# EAGLE design Phototransistor (EAGLE 9.6.2)
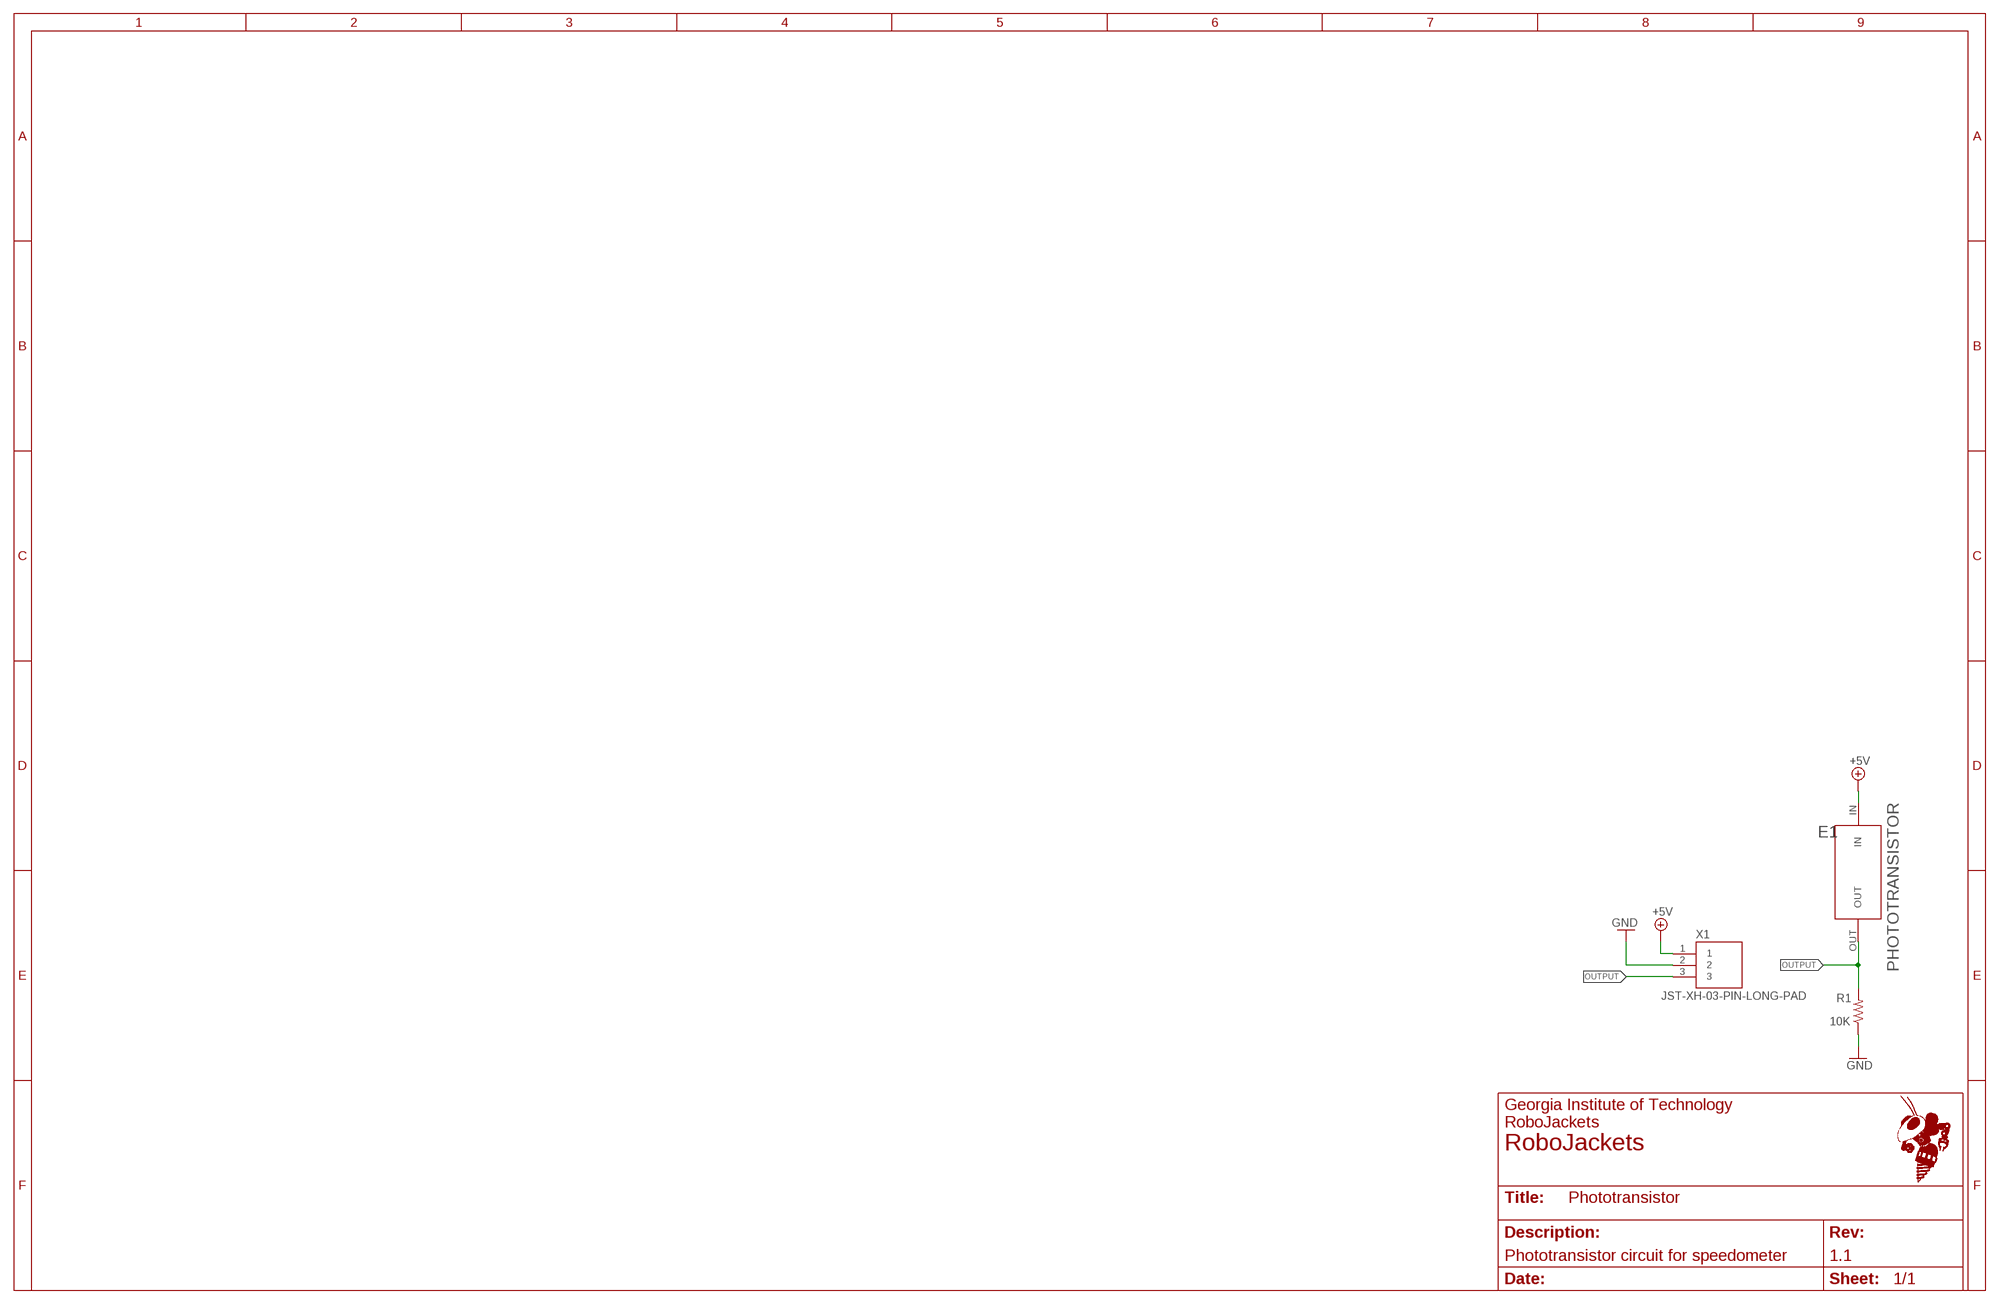
[diagram p0: schematic, sheet 1]
FRAME1 (FRAME_11_17): REVISION: 1.1; SCH_DESC: Phototransistor circuit for speedometer; TEAM: RoboJackets

## Parts
E1  PHOTOTRANSISTOR  [STD_FP]
R1  10K  R-US_R0603  [R0603]
X1  JST-XH-03-PIN-LONG-PAD  [JST-XH-03-PACKAGE-LONG-PAD]

## Nets
+5V: E1.IN X1.1
GND: R1.1 X1.2
OUTPUT: E1.OUT R1.2 X1.3

## Library data of the parts
E1 = SpeedometerParts:PHOTOTRANSISTOR: Abstract phototransistor, for use in speedometer schematic
R1 = rcl:R-US_: RESISTOR, American symbol; SPICEPREFIX: R
X1 = RoboJackets-Connectors:JST-XH-03-PIN: JST XH Connector 2 Pin Wire to board connector. Pitch: 2,54 mm, (0.100") Number of pins: 3 Created by Rembrandt Electronics www.rembrandtelectronics.com

## Board
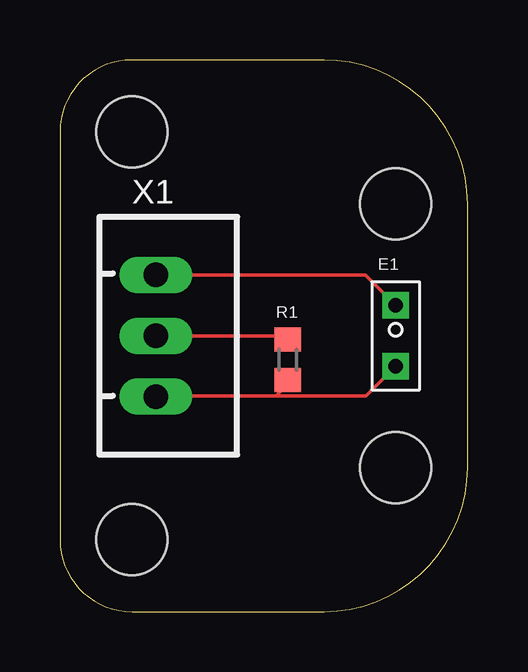
[diagram p1: board, top side]

Size 17 x 23 mm. Coordinates in mm from the lower left corner, seen from the top.
Outline: 3,0 11,0 arc90 17,6 17,17 arc90 11,23 3,23 arc90 0,20 0,3 arc90 3,0
Copper layers (1*16): Top 0.035mm / dielectric 1.5mm / Bottom 0.035mm
Design rules "default": minimum track width 6mil, minimum drill 0.35mm, track to track 6mil, track to pad 6mil, pad to pad 6mil, via to via 6mil, smd to smd 6mil, copper to edge 40mil, drill to drill 6mil, minimum pad ring 10mil, minimum via ring 8mil, stop-mask expansion 4mil, vias tented up to drill 0mil, thermal gap 10mil
Holes 2.95 mm at 3,20 3,3 14,6 14,17

### Footprints (pad centres in the part's own frame; a part is rotated, then mirrored left to right if it is on the bottom)
STD_FP = drill 0.6 square: IN -1.27,0; OUT 1.27,0
R0603 = smd 1 x 1.1: 1 -0.85,0; 2 0.85,0
JST-XH-03-PACKAGE-LONG-PAD = drill 1.016 long: 1 -2.54,0; 2 0,0; 3 2.54,0

### Placement (x,y rotation side)
E1  14,11.5 270 top
R1  9.5,10.5 270 top
X1  4,11.5 270 top

### Tracks (layer width: path | path; a pad name or v marks a point on that pad's centre or on a via)
+5V
  Top 0.152: X1.1 12.73,14.04 E1.IN
GND
  Top 0.152: 9.53,11.32 R1.1 9.35,11.5 X1.2
OUTPUT
  Top 0.152: X1.3 4.04,9 9,9 | E1.OUT 12.77,9 9,9 | R1.2 9.5,9.5 9,9